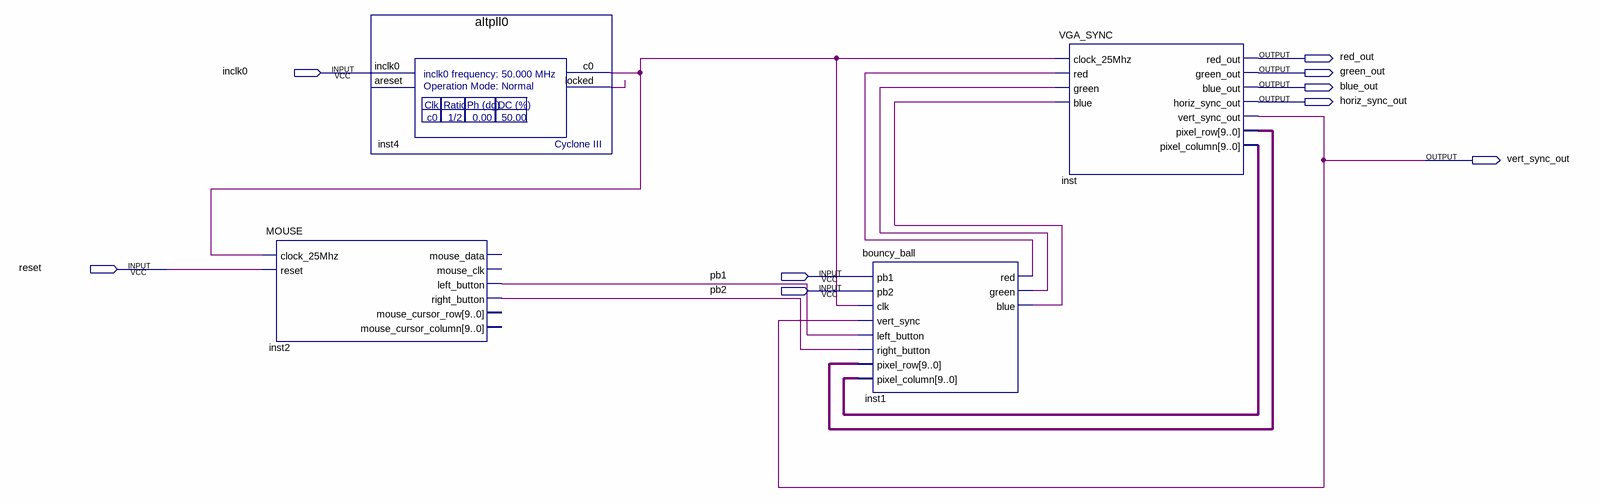
[diagram p0: schematic sheet]
// Quartus schematic BallMovement.bdf as structural Verilog: 4 symbols, 9 pins
module BallMovement (
  input  inclk0,
  input  reset,
  input  pb1,
  input  pb2,
  output red_out,
  output green_out,
  output blue_out,
  output horiz_sync_out,
  output vert_sync_out
);

  wire inst1_blue, inst1_green, inst1_red, inst2_left_button, inst2_right_button, inst4_c0, inst4_locked;
  wire [9:0] inst_pixel_column, inst_pixel_row;

  MOUSE inst2 (
    .clock_25Mhz(inst4_c0), .reset(reset), .left_button(inst2_left_button), .right_button(inst2_right_button));  // open: mouse_cursor_row, mouse_cursor_column, mouse_data, mouse_clk
  altpll0 inst4 (.inclk0(inclk0), .c0(inst4_c0), .locked(inst4_locked));  // open: areset
  bouncy_ball inst1 (
    .pb1(pb1), .pb2(pb2), .clk(inst4_c0), .vert_sync(vert_sync_out), .left_button(inst2_left_button),
    .right_button(inst2_right_button), .pixel_row(inst_pixel_row), .pixel_column(inst_pixel_column),
    .red(inst1_red), .green(inst1_green), .blue(inst1_blue));
  VGA_SYNC inst (
    .clock_25Mhz(inst4_c0), .red(inst1_red), .green(inst1_green), .blue(inst1_blue), .red_out(red_out),
    .green_out(green_out), .blue_out(blue_out), .horiz_sync_out(horiz_sync_out),
    .vert_sync_out(vert_sync_out), .pixel_row(inst_pixel_row), .pixel_column(inst_pixel_column));
endmodule
